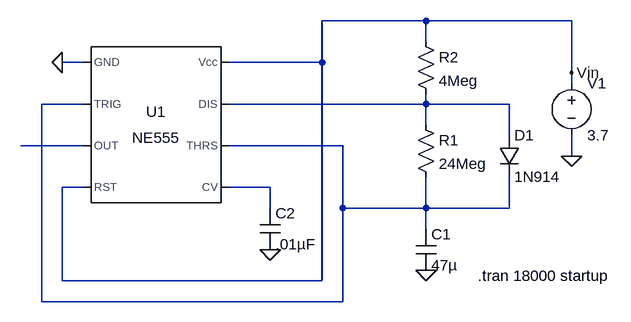
[diagram p0: schematic 7555LTSpice.asc]
7555LTSpice.asc, the LTspice schematic file:
Version 4
SHEET 1 1088 740
WIRE 208 96 48 96
WIRE 432 96 208 96
WIRE 208 128 208 96
WIRE -320 160 -352 160
WIRE 48 160 48 96
WIRE 48 160 -96 160
WIRE 432 176 432 96
WIRE 432 192 432 176
WIRE -320 224 -384 224
WIRE 208 224 208 208
WIRE 208 224 -96 224
WIRE 336 224 208 224
WIRE 208 256 208 224
WIRE 336 272 336 224
WIRE -320 288 -416 288
WIRE 80 288 -96 288
WIRE 432 304 432 272
WIRE -320 352 -352 352
WIRE -32 352 -96 352
WIRE -32 384 -32 352
WIRE 80 384 80 288
WIRE 208 384 208 336
WIRE 208 384 80 384
WIRE 336 384 336 336
WIRE 336 384 208 384
WIRE 208 416 208 384
WIRE -352 496 -352 352
WIRE 48 496 48 160
WIRE 48 496 -352 496
WIRE -384 528 -384 224
WIRE 80 528 80 384
WIRE 80 528 -384 528
FLAG -352 160 0
FLAG 208 480 0
FLAG 432 304 0
FLAG 432 176 Vin
FLAG -32 448 0
SYMBOL Misc\\NE555 -208 256 R0
SYMATTR InstName U1
SYMBOL res 192 240 R0
SYMATTR InstName R1
SYMATTR Value 24Meg
SYMBOL res 192 112 R0
SYMATTR InstName R2
SYMATTR Value 4Meg
SYMBOL cap 192 416 R0
SYMATTR InstName C1
SYMATTR Value 47µ
SYMBOL voltage 432 176 R0
WINDOW 123 0 0 Left 0
WINDOW 39 0 0 Left 0
SYMATTR InstName V1
SYMATTR Value 3.7
SYMBOL diode 320 272 R0
SYMATTR InstName D1
SYMATTR Value 1N914
SYMBOL cap -48 384 R0
SYMATTR InstName C2
SYMATTR Value .01µF
TEXT 288 488 Left 0 !.tran 18000 startup

The netlist it stands for:
* 7555LTSpice.asc
XU1 0 N001 N003 Vin N004 N001 N002 Vin NE555  ; pins GND TRIG OUT RST CV THRS DIS Vcc
R1 N002 N001 24Meg
R2 Vin N002 4Meg
C1 N001 0 47µ
V1 Vin 0 3.7
D1 N002 N001 1N914
C2 N004 0 .01µF
.model D D
.lib standard.dio
.tran 18000 startup
.lib NE555.sub
.backanno
.end